# Altium project Assignment_EEC.PrjPcb
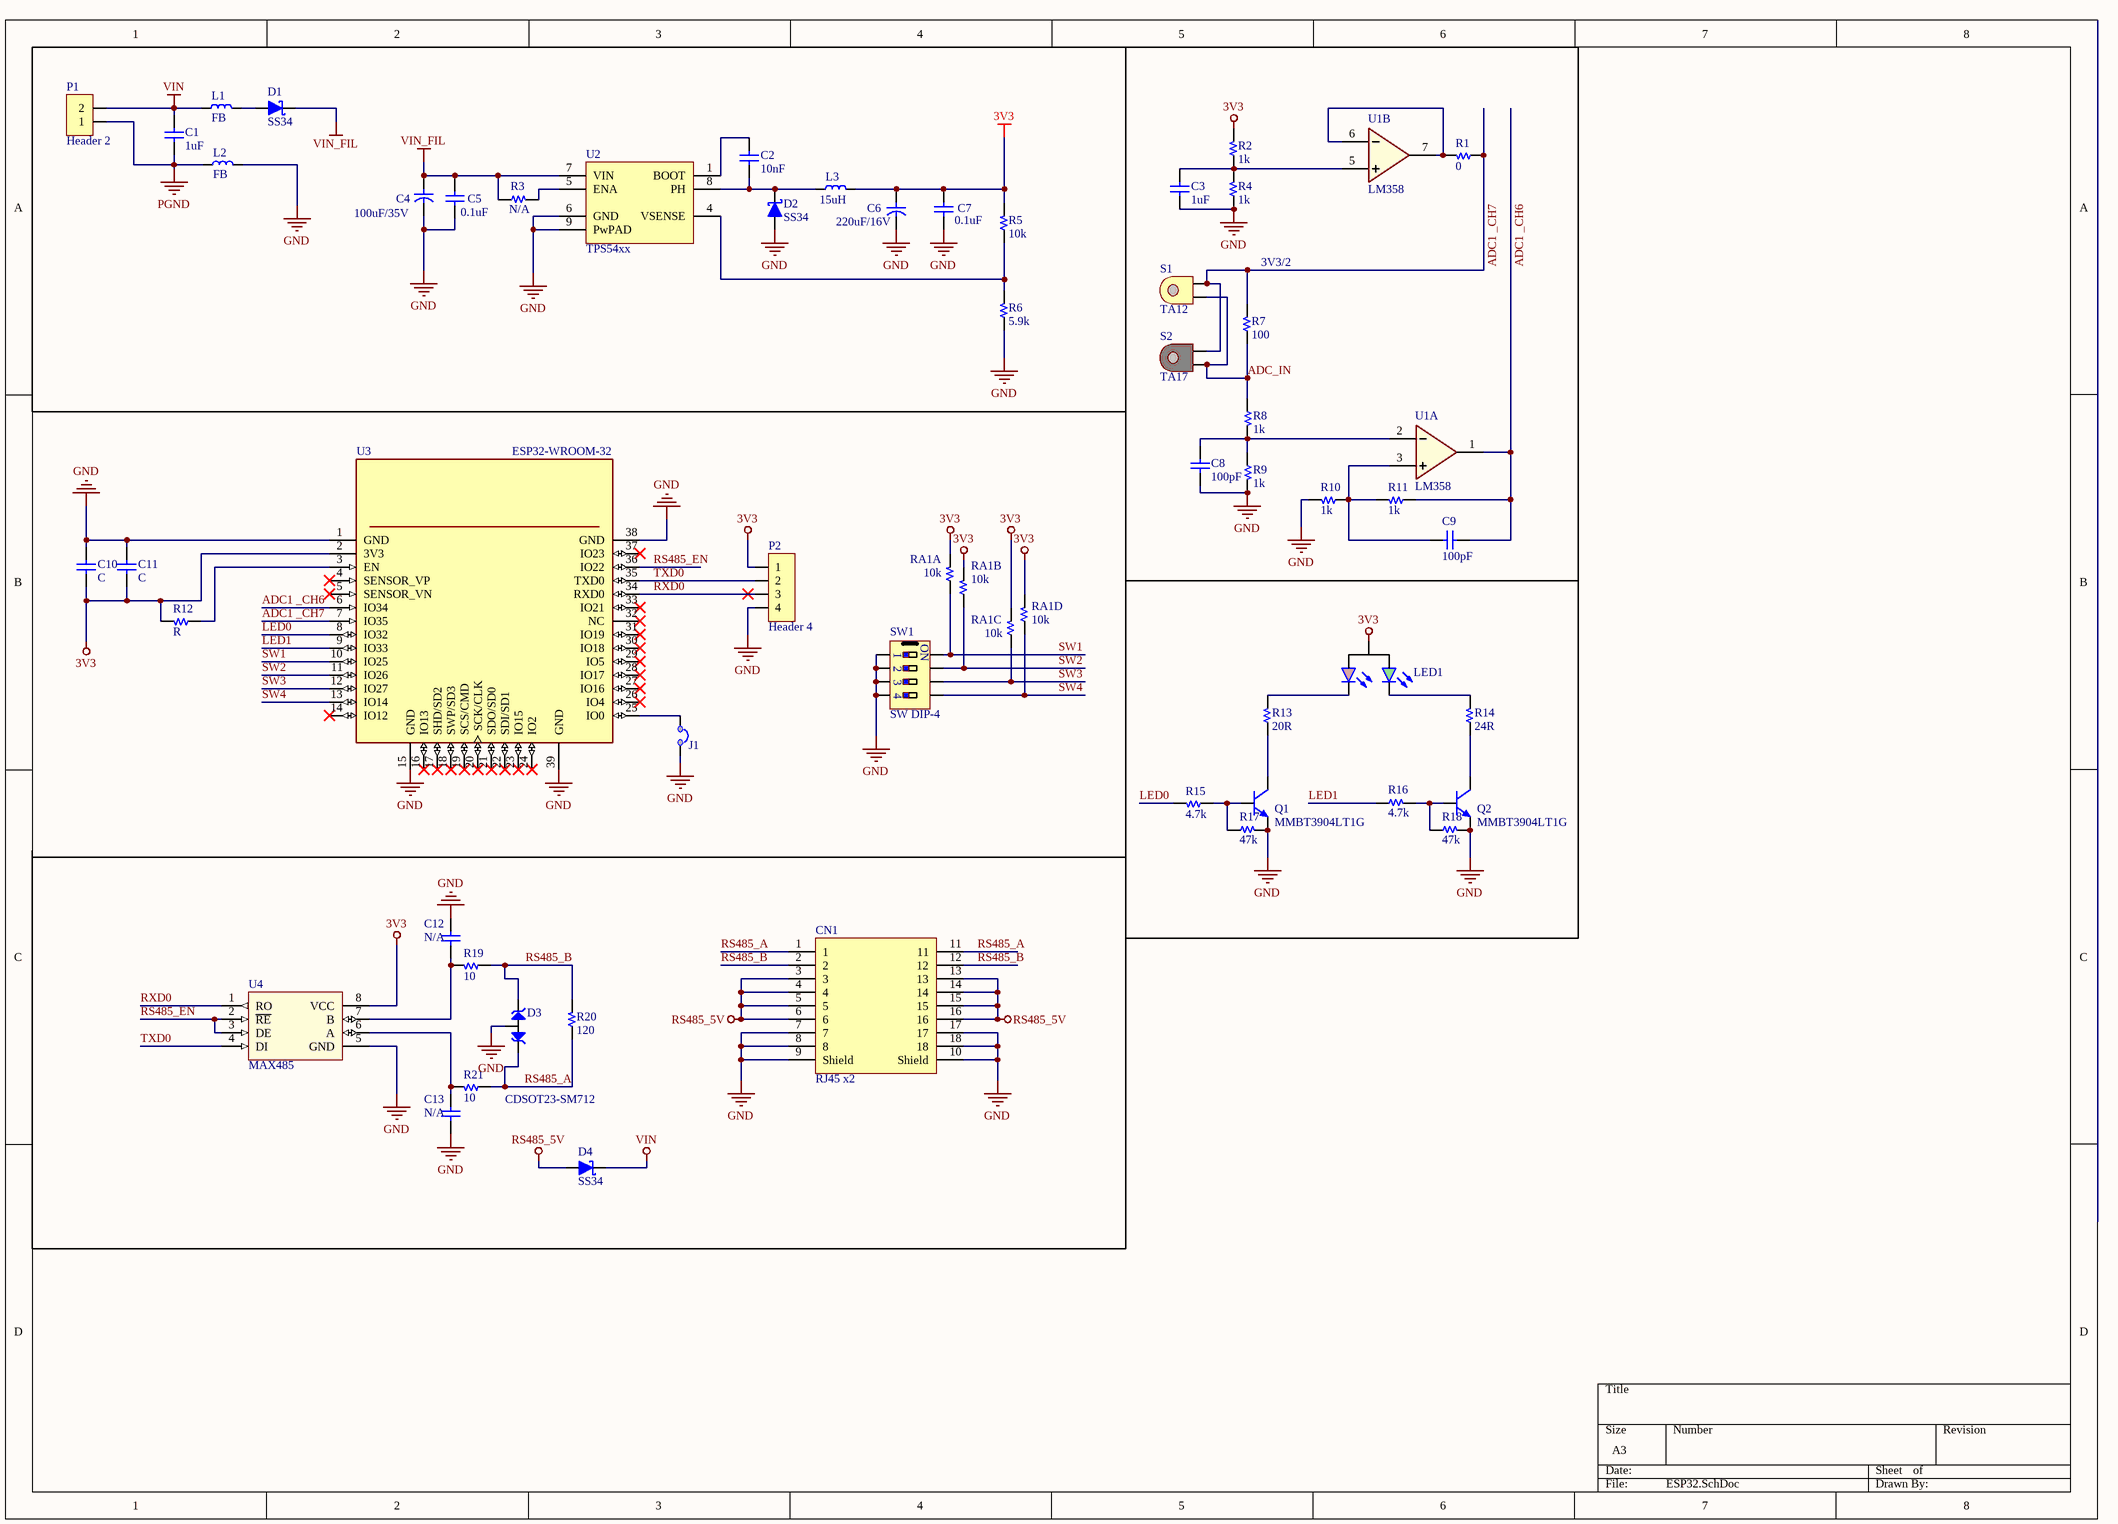
[diagram p0: ESP32.SchDoc]
1 sheet, 56 parts. Net scope: global (net labels, ports and power ports of the same name join across sheets).
Board file: ESP32.PcbDoc

## Sheet ESP32.SchDoc
size A3; SheetNumber: 1; SheetTotal: 1

### Parts
C1  1uF  [C 0805]
C2  10nF  [C 0805]
C3  1uF  [C 0805]
C4  100uF/35V  [C SMD TAN 1206 (A)]
C5  0.1uF  [C 0805]
C6  220uF/16V  [C SMD TAN 1206 (A)]
C7  0.1uF  [C 0805]
C8  100pF  [C 0805]
C9  100pF  [C 0805]
C10  C  [C 0805]
C11  C  [C 0805]
C12  N/A  [C 0805]
C13  N/A  [C 0805]
CN1  RJ45 x2  [CONN/RJ45/x2]
D1  SS34  [DO-214AC (SMA)]
D2  SS34  [DO-214AC (SMA)]
D3  CDSOT23-SM712  [SOT-23]
D4  SS34  [DO-214AB (SMC)]
J1  JUMP 2  [JUMP/2/Close]  (value not drawn)  (no BOM)
L1  FB  [Inductor SMD 0805 (2012)]
L2  FB  [Inductor SMD 0805 (2012)]
L3  15uH  [Inductor SMD 0805 (2012)]
LED1  Led 3pin 2color  [LED 3PIN 2COLOR 5MM]  (value not drawn)
P1  Header 2  [HDR/Header/2/BOX]
P2  Header 4  [HDR/Header/4/BOX/RA]
Q1  MMBT3904LT1G  [SOT-23]
Q2  MMBT3904LT1G  [SOT-23]
R1  0  [R 0805]
R2  1k  [R 0805]
R3  N/A  [R 0805]
R4  1k  [R 0805]
R5  10k  [R 0805]
R6  5.9k  [R 0805]
R7  100  [R 0805]
R8  1k  [R 0805]
R9  1k  [R 0805]
R10  1k  [R 0805]
R11  1k  [R 0805]
R12  R  [R 0805]
R13  20R  [R 0805]
R14  24R  [R 0805]
R15  4.7k  [R 0805]
R16  4.7k  [R 0805]
R17  47k  [R 0805]
R18  47k  [R 0805]
R19  10  [R 0805]
R20  120  [R 0805]
R21  10  [R 0805]
RA1  10k  [RAx4 1206 (3216)]  (parts A,B,C,D of 4)
S1  TA12  [TA12]
S2  TA17  [TA17]
SW1  SW DIP-4  [SW/DIP4]
U1  LM358  [SOIC-8]  (parts A,B of 2)
U2  TPS54xx  [SOIC-8 EP]
U3  ESP32-WROOM-32  [MODULE_ESP32-WROOM-32]
U4  MAX485  [SOIC-8]

### Nets
3V3: C6.1 C7.1 C10.2 C11.2 L3.2 LED1.2(A) P2.1 R2.2 R5.2 R12.1 RA1.5 RA1.6 RA1.7 RA1.8 U3.2(3V3) U4.8(VCC)
GND: C3.1 C4.2 C5.2 C6.2 C7.2 C8.2 C10.1 C11.1 C12.1 C13.2 CN1.7 CN1.8 CN1.9(Shield) CN1.10(Shield) CN1.17 CN1.18 D2.1(A) D3.3(COM) J1.2 L2.2 P2.4 Q1.2(E) Q2.2(E) R4.1 R6.1 R9.2 R10.2 R17.2 R18.2 SW1.1 SW1.2 SW1.3 SW1.4 U1.4(GND) U2.6(GND) U2.9(PwPAD) U3.1(GND) U3.15(GND) U3.38(GND) U3.39(GND) U4.5(GND)
PGND: C1.2 L2.1 P1.1
RS485_5V: CN1.3 CN1.4 CN1.5 CN1.6 CN1.13 CN1.14 CN1.15 CN1.16 D4.1(A)
VCC: U1.8(VCC)
VIN: C1.1 D4.2(K) L1.1 P1.2
VIN_FIL: C4.1 C5.1 D1.2(K) R3.1 U2.7(VIN)
ADC1 _CH6: C9.2 R11.1 U1.1(OutA) U3.6(IO34)
ADC1 _CH7: R1.1 R7.2 S1.2 S2.2 U3.7(IO35)
ADC_IN: R7.1 R8.1 S1.1 S2.1
LED0: R15.2 U3.8(IO32)
LED1: R16.1 U3.9(IO33)
RS485_A: CN1.1 CN1.11 D3.1(IO1) R20.1 R21.1
RS485_B: CN1.2 CN1.12 D3.2(IO2) R19.1 R20.2
RS485_EN: U3.36(IO22) U4.2(~{RE}) U4.3(DE)
RXD0: P2.3 U3.34(RXD0) U4.1(RO)
SW1: RA1.1 SW1.8 U3.10(IO25)
SW2: RA1.2 SW1.7 U3.11(IO26)
SW3: RA1.3 SW1.6 U3.12(IO27)
SW4: RA1.4 SW1.5 U3.13(IO14)
TXD0: P2.2 U3.35(TXD0) U4.4(DI)
NetC2_1: C2.1 U2.1(BOOT)
NetC2_2: C2.2 D2.2(K) L3.1 U2.8(PH)
NetC3_2: C3.2 R2.1 R4.2 U1.5(B+)
NetC8_1: C8.1 R8.2 R9.1 U1.2(A-)
NetC9_1: C9.1 R10.1 R11.2 U1.3(A+)
NetC12_2: C12.2 R19.2 U4.7(B)
NetC13_1: C13.1 R21.2 U4.6(A)
NetD1_1: D1.1(A) L1.2
NetJ1_1: J1.1 U3.25(IO0)
NetLED1_1: LED1.1(RK) R13.2
NetLED1_3: LED1.3(YK) R14.2
NetQ1_1: Q1.1(B) R15.1 R17.1
NetQ1_3: Q1.3(C) R13.1
NetQ2_1: Q2.1(B) R16.2 R18.1
NetQ2_3: Q2.3(C) R14.1
NetR1_2: R1.2 U1.6(B-) U1.7(OutB)
NetR3_2: R3.2 U2.5(ENA)
NetR5_1: R5.1 R6.2 U2.4(VSENSE)
NetR12_2: R12.2 U3.3(EN)

Not connected (* = marked no-connect by the designer): U3 4(SENSOR_VP)* 5(SENSOR_VN)* 14(IO12)* 16(IO13)* 17(SHD/SD2)* 18(SWP/SD3)* 19(SCS/CMD)* 20(SCK/CLK)* 21(SDO/SD0)* 22(SDI/SD1)* 23(IO15)* 24(IO2)* 26(IO4)* 27(IO16)* 28(IO17)* 29(IO5)* 30(IO18)* 31(IO19)* 32(NC)* 33(IO21)* 37(IO23)*

### Notes on the sheet
- 3V3/2
- (in symbol SW DIP-4) ON

### Library data of the parts
C1-C3 C5 C7-C13 = Capacitor NP: Capacitor non-pol
C4 C6 = Capacitor: Capacitor pol
CN1 = CON RJ45 x2: Connector RJ45 X2
D1 D2 D4 = Diode Schottky: Schottky Diode
D3 = CDSOT23-SM712: TVS DIODE 7V/12V 14V/26V SOT23-3
L1-L3 = Inductor
LED1 = Led 3pin 2color: Typical LED 3-pin 2-color
P1 = Header 2: Header, 2-Pin
P2 = Header 4: Header, 4-Pin
Q1 Q2 = Transistor NPN: NPN Bipolar Transistor
R1-R21 = Resistor
RA1 = Resistor Array x4
U1 = LM358: Low Power Dual Operational Amplifiers
U2 = TPS54xx: 3/5A, Wide input range, Step-down SWIFT DC-DC Converter
U3 = ESP32-WROOM-32: Bluetooth, WiFi 802.11b/g/n, Bluetooth v4.2 + EDR, Class 1, 2 and 3 Transceiver Module 2.4GHz ~ 2.5GHz Integrated, Trace Surface Mount; MF: Espressif Systems; MP: ESP32-WROOM-32D; Price: None; Package: Module Espressif Systems; Availability: Unavailable; SnapEDA_Link: https://www.snapeda.com/parts/ESP32-WROOM-32D/Espressif%20Systems/view-part/2768115/?ref=snap; Value: *
U4 = MAX485: Low-Power, Slew-Rate-Limited  RS-485/RS-422 Transceivers